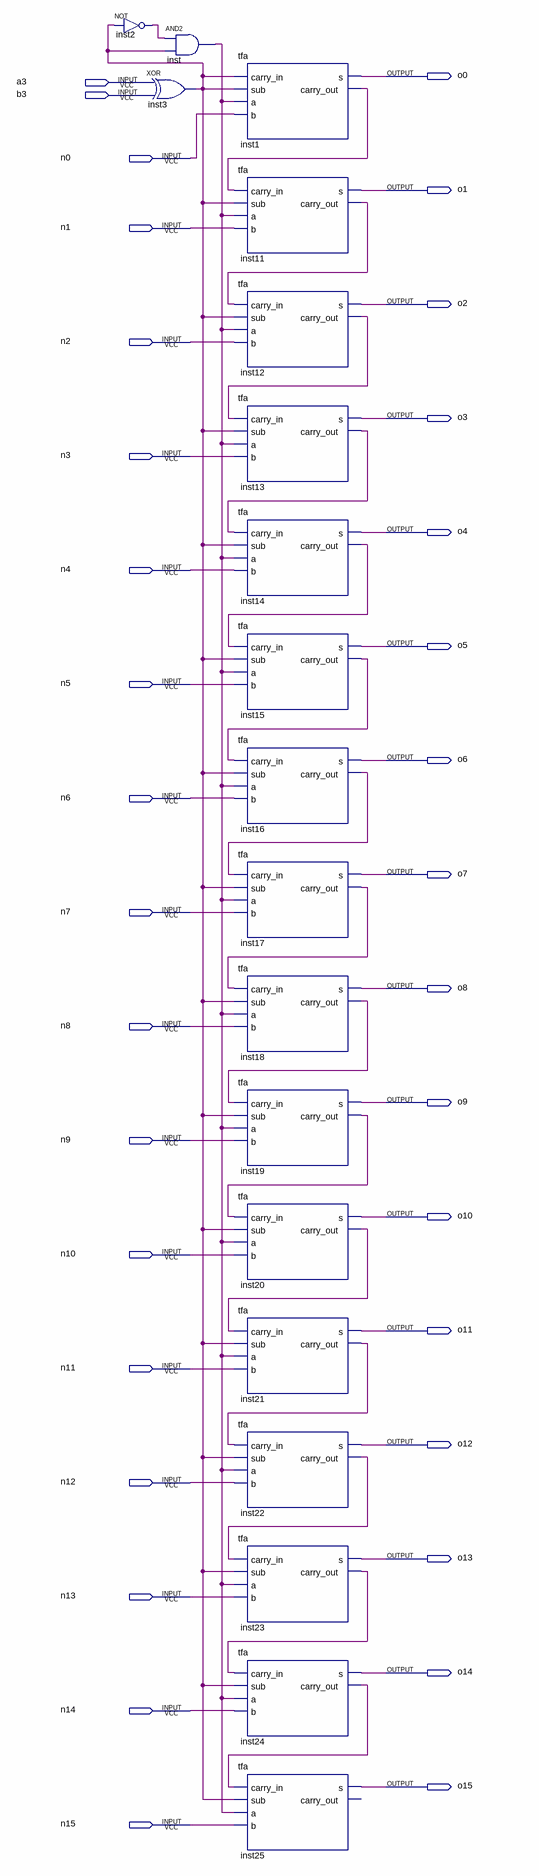
[diagram p0: schematic sheet]
// Quartus schematic qb.bdf as structural Verilog: 19 symbols, 34 pins
module qb (
  input  a3,
  input  b3,
  input  n0,
  input  n1,
  input  n2,
  input  n3,
  input  n4,
  input  n5,
  input  n6,
  input  n7,
  input  n8,
  input  n9,
  input  n10,
  input  n11,
  input  n12,
  input  n13,
  input  n14,
  input  n15,
  output o0,
  output o1,
  output o2,
  output o3,
  output o4,
  output o5,
  output o6,
  output o7,
  output o8,
  output o9,
  output o10,
  output o11,
  output o12,
  output o13,
  output o14,
  output o15
);

  wire inst1_carry_out, inst2_out, inst3_out, inst11_carry_out, inst12_carry_out, inst13_carry_out,
       inst14_carry_out, inst15_carry_out, inst16_carry_out, inst17_carry_out, inst18_carry_out,
       inst19_carry_out, inst20_carry_out, inst21_carry_out, inst22_carry_out, inst23_carry_out,
       inst24_carry_out, inst_out;

  not inst2 (inst2_out, inst3_out);
  and inst (inst_out, inst2_out, inst3_out);
  xor inst3 (inst3_out, a3, b3);
  tfa inst1 (.carry_in(inst3_out), .sub(inst3_out), .a(inst_out), .b(n0), .s(o0), .carry_out(inst1_carry_out));
  tfa inst11 (.carry_in(inst1_carry_out), .sub(inst3_out), .a(inst_out), .b(n1), .s(o1), .carry_out(inst11_carry_out));
  tfa inst12 (.carry_in(inst11_carry_out), .sub(inst3_out), .a(inst_out), .b(n2), .s(o2), .carry_out(inst12_carry_out));
  tfa inst13 (.carry_in(inst12_carry_out), .sub(inst3_out), .a(inst_out), .b(n3), .s(o3), .carry_out(inst13_carry_out));
  tfa inst14 (.carry_in(inst13_carry_out), .sub(inst3_out), .a(inst_out), .b(n4), .s(o4), .carry_out(inst14_carry_out));
  tfa inst15 (.carry_in(inst14_carry_out), .sub(inst3_out), .a(inst_out), .b(n5), .s(o5), .carry_out(inst15_carry_out));
  tfa inst16 (.carry_in(inst15_carry_out), .sub(inst3_out), .a(inst_out), .b(n6), .s(o6), .carry_out(inst16_carry_out));
  tfa inst17 (.carry_in(inst16_carry_out), .sub(inst3_out), .a(inst_out), .b(n7), .s(o7), .carry_out(inst17_carry_out));
  tfa inst18 (.carry_in(inst17_carry_out), .sub(inst3_out), .a(inst_out), .b(n8), .s(o8), .carry_out(inst18_carry_out));
  tfa inst19 (.carry_in(inst18_carry_out), .sub(inst3_out), .a(inst_out), .b(n9), .s(o9), .carry_out(inst19_carry_out));
  tfa inst20 (
    .carry_in(inst19_carry_out), .sub(inst3_out), .a(inst_out), .b(n10), .s(o10), .carry_out(inst20_carry_out));
  tfa inst21 (
    .carry_in(inst20_carry_out), .sub(inst3_out), .a(inst_out), .b(n11), .s(o11), .carry_out(inst21_carry_out));
  tfa inst22 (
    .carry_in(inst21_carry_out), .sub(inst3_out), .a(inst_out), .b(n12), .s(o12), .carry_out(inst22_carry_out));
  tfa inst23 (
    .carry_in(inst22_carry_out), .sub(inst3_out), .a(inst_out), .b(n13), .s(o13), .carry_out(inst23_carry_out));
  tfa inst24 (
    .carry_in(inst23_carry_out), .sub(inst3_out), .a(inst_out), .b(n14), .s(o14), .carry_out(inst24_carry_out));
  tfa inst25 (.carry_in(inst24_carry_out), .sub(inst3_out), .a(inst_out), .b(n15), .s(o15));  // open: carry_out
endmodule
